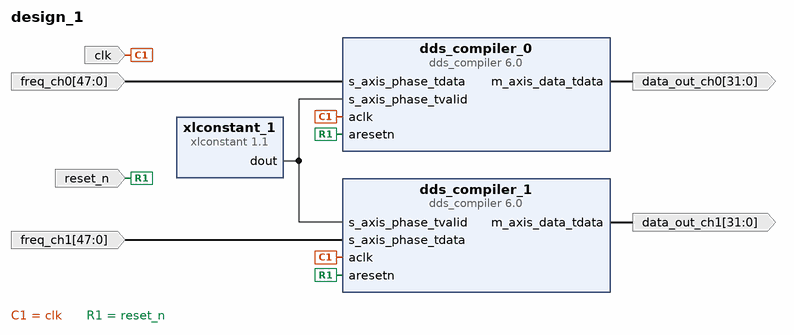
[diagram p0: block diagram of the top level]
# Vivado block design design_1, xczu9eg-ffvb1156-2-i, Vivado 2019.1.3
create_bd_design design_1

create_bd_port -dir I -from 47 -to 0 freq_ch0
create_bd_port -dir O -from 31 -to 0 data_out_ch0
create_bd_port -dir I -type clk clk
set_property -dict {CONFIG.FREQ_HZ 400000000} [get_bd_ports clk]
create_bd_port -dir I -type rst reset_n
create_bd_port -dir I -from 47 -to 0 freq_ch1
create_bd_port -dir O -from 31 -to 0 data_out_ch1

create_bd_cell -type ip -vlnv xilinx.com:ip:dds_compiler:6.0 dds_compiler_0
set_property -dict [list \
  CONFIG.Channels 1 \
  CONFIG.DATA_Has_TLAST Not_Required \
  CONFIG.DDS_Clock_Rate 400 \
  CONFIG.Has_ACLKEN false \
  CONFIG.Has_ARESETn true \
  CONFIG.Has_Phase_Out false \
  CONFIG.Latency 9 \
  CONFIG.M_DATA_Has_TUSER Not_Required \
  CONFIG.M_PHASE_Has_TUSER Not_Required \
  CONFIG.Noise_Shaping None \
  CONFIG.Output_Frequency1 0 \
  CONFIG.Output_Width 16 \
  CONFIG.PINC1 0 \
  CONFIG.Parameter_Entry Hardware_Parameters \
  CONFIG.PartsPresent Phase_Generator_and_SIN_COS_LUT \
  CONFIG.Phase_Increment Streaming \
  CONFIG.Phase_Width 48 \
  CONFIG.Phase_offset None \
  CONFIG.S_PHASE_Has_TUSER Not_Required \
] [get_bd_cells dds_compiler_0]
create_bd_cell -type ip -vlnv xilinx.com:ip:xlconstant:1.1 xlconstant_1
create_bd_cell -type ip -vlnv xilinx.com:ip:dds_compiler:6.0 dds_compiler_1
set_property -dict [list \
  CONFIG.Channels 1 \
  CONFIG.DATA_Has_TLAST Not_Required \
  CONFIG.DDS_Clock_Rate 400 \
  CONFIG.Has_ACLKEN false \
  CONFIG.Has_ARESETn true \
  CONFIG.Has_Phase_Out false \
  CONFIG.Latency 9 \
  CONFIG.M_DATA_Has_TUSER Not_Required \
  CONFIG.M_PHASE_Has_TUSER Not_Required \
  CONFIG.Noise_Shaping None \
  CONFIG.Output_Frequency1 0 \
  CONFIG.Output_Width 16 \
  CONFIG.PINC1 0 \
  CONFIG.Parameter_Entry Hardware_Parameters \
  CONFIG.PartsPresent Phase_Generator_and_SIN_COS_LUT \
  CONFIG.Phase_Increment Streaming \
  CONFIG.Phase_Width 48 \
  CONFIG.Phase_offset None \
  CONFIG.S_PHASE_Has_TUSER Not_Required \
] [get_bd_cells dds_compiler_1]

# ---- connections ----

connect_bd_net [get_bd_pins xlconstant_1/dout] [get_bd_pins dds_compiler_0/s_axis_phase_tvalid] [get_bd_pins dds_compiler_1/s_axis_phase_tvalid]
connect_bd_net -net s_axis_phase_tdata_0_1 [get_bd_ports freq_ch0] [get_bd_pins dds_compiler_0/s_axis_phase_tdata]
connect_bd_net [get_bd_pins dds_compiler_0/m_axis_data_tdata] [get_bd_ports data_out_ch0]
connect_bd_net -net aclk_0_1 [get_bd_ports clk] [get_bd_pins dds_compiler_0/aclk] [get_bd_pins dds_compiler_1/aclk]
connect_bd_net -net aresetn_0_1 [get_bd_ports reset_n] [get_bd_pins dds_compiler_0/aresetn] [get_bd_pins dds_compiler_1/aresetn]
connect_bd_net -net freq_ch1_1 [get_bd_ports freq_ch1] [get_bd_pins dds_compiler_1/s_axis_phase_tdata]
connect_bd_net [get_bd_pins dds_compiler_1/m_axis_data_tdata] [get_bd_ports data_out_ch1]

validate_bd_design
save_bd_design
